# Altium schematic sheet RX5808_TOP.SchDoc
size A4; SheetNumber: 1; SheetTotal: 1
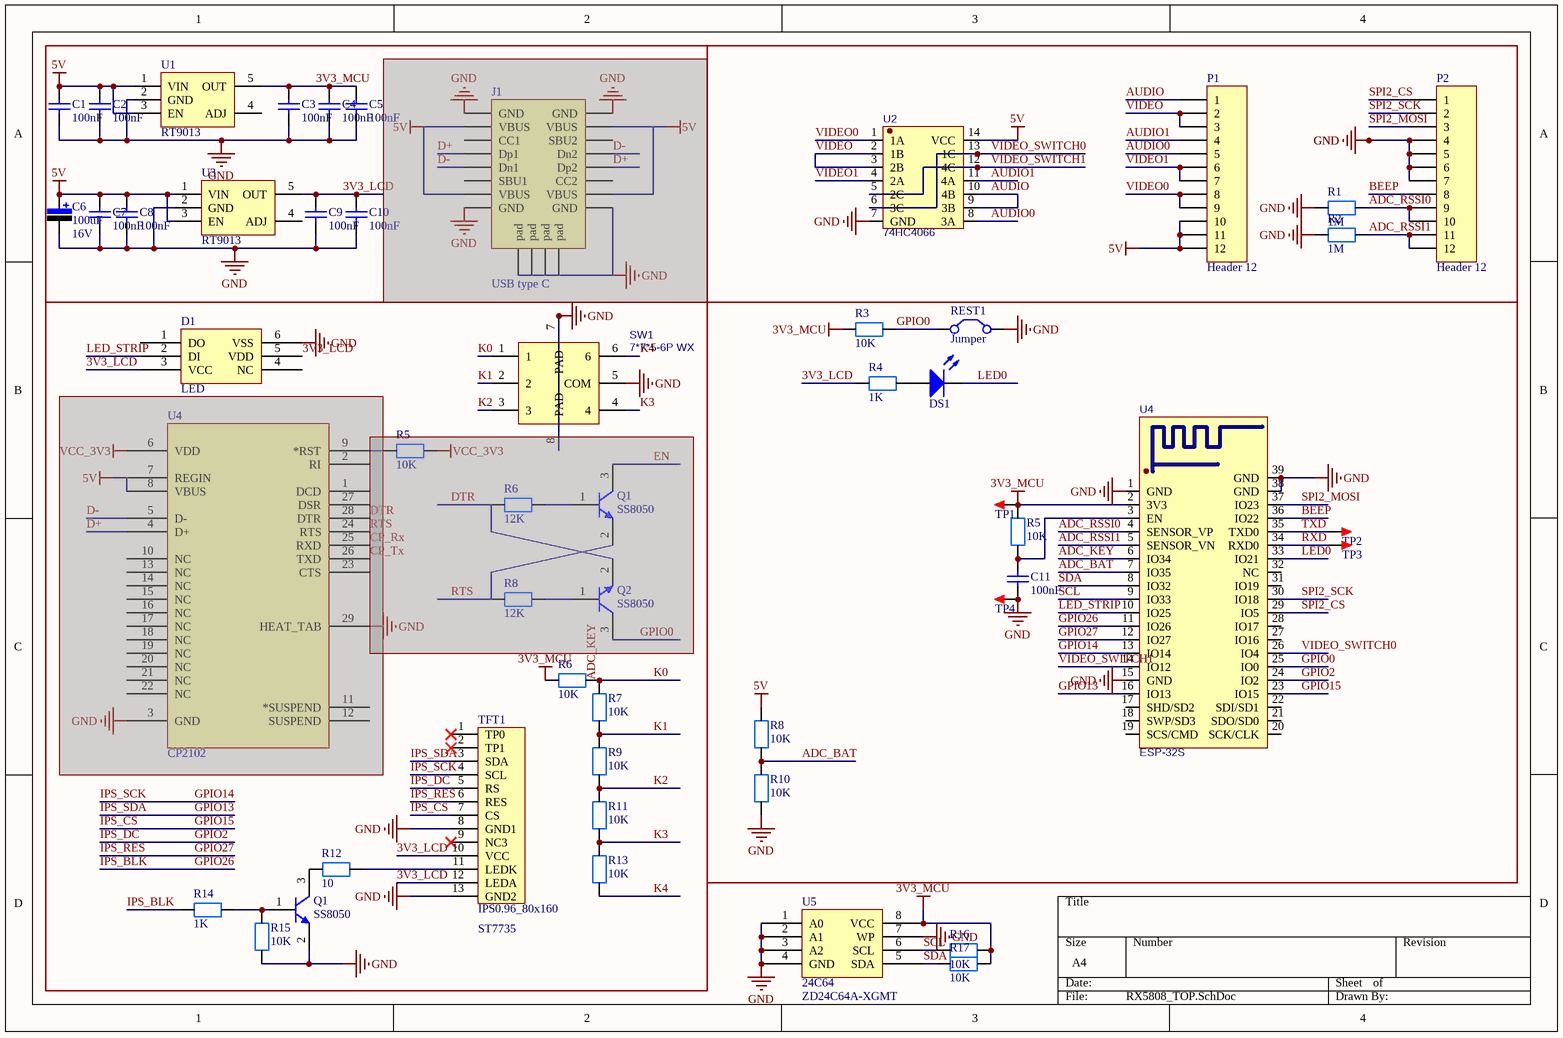
[diagram p0: RX5808_TOP.SchDoc]

## Parts
(Parts that share a designator on the sheet are numbered #1, #2 ... from top to bottom, then left to right.)
C1  value 100nF  [0603_CAP]  (hidden comment: Cap)
C2  value 100nF  [0603_CAP]  (hidden comment: Cap)
C3  value 100nF  [0603_CAP]  (hidden comment: Cap)
C4  value 100nF  [0603_CAP]  (hidden comment: Cap)
C5  value 100nF  [0603_CAP]  (hidden comment: Cap)
C6  value 100uF  Vol: 16V  [CAP-3216]  (hidden comment: Cap Pol)
C7  value 100nF  [0603_CAP]  (hidden comment: Cap)
C8  value 100nF  [0603_CAP]  (hidden comment: Cap)
C9  value 100nF  [0603_CAP]  (hidden comment: Cap)
C10  value 100nF  [0603_CAP]  (hidden comment: Cap)
C11  value 100nF  [0603_CAP]  (hidden comment: Cap)
D1  LED  [LED-SMD_6P-L5.0-W5.0-TL]
DS1  LED  [0603_LED]  (value not drawn)
J1  USB type C  [USB Type-C-16Pin_A]  (masked out: inside a compile mask, not in the netlist)
P1  Header 12  [HDR1.27-1x12]
P2  Header 12  [HDR1.27-1x12]
Q1#1  SS8050  [SOT23A]  (masked out: inside a compile mask, not in the netlist)
Q1#2  SS8050  [SOT23A]
Q2  SS8050  [SOT23A]  (masked out: inside a compile mask, not in the netlist)
R1  1M  [0603_RES]
R2  1M  [0603_RES]
R3  10K  [0603_RES]
R4  1K  [0603_RES]
R5#1  10K  [0603_RES]  (masked out: inside a compile mask, not in the netlist)
R5#2  10K  [0603_RES]
R6#1  12K  [0603_RES]  (masked out: inside a compile mask, not in the netlist)
R6#2  10K  [0603_RES]
R7  10K  [0603_RES]
R8#1  12K  [0603_RES]  (masked out: inside a compile mask, not in the netlist)
R8#2  10K  [0603_RES]
R9  10K  [0603_RES]
R10  10K  [0603_RES]
R11  10K  [0603_RES]
R12  10  [0603_RES]
R13  10K  [0603_RES]
R14  1K  [0603_RES]
R15  10K  [0603_RES]
R16  10K  [0603_RES]
R17  10K  [0603_RES]
REST1  Jumper  [SW-SMD_ST-1195]
SW1  7*7*5-6P WX  [SW-SMD_8P-L7.0-W7.0-P1.40-LS7.4-TL]
TFT1  IPS0.96_80x160  [IPS-0.96]
TP1  TEST  [TEST1.0]  (value not drawn)
TP2  TEST  [TEST1.0]  (value not drawn)
TP3  TEST  [TEST1.0]  (value not drawn)
TP4  TEST  [TEST1.0]  (value not drawn)
U1  RT9013  [SOT-23-5_L3.0-W1.7-P0.95-LS2.8-TL]
U2  74HC4066  [TSSOP-14_L5.0-W4.4-P0.65-LS6.4-BL]
U3  RT9013  [SOT-23-5_L3.0-W1.7-P0.95-LS2.8-TL]
U4#1  CP2102  [QFN-28]  (masked out: inside a compile mask, not in the netlist)
U4#2  ESP-32S  [WIFIM-SMD_ESP-32S]
U5  24C64  [TSSOP-8_L4.4-W3.0-P0.65-LS6.4-BL-2]

## Nets
3V3_MCU: C3.1 C4.2 C5.2 R3.2 R5#2.1 R6#2.1 R16.1 R17.1 TP1.1 U1.5(OUT) U4#2.2(3V3) U5.8(VCC)
5V: C1.2 C2.1 C6.1 C7.2 C8.1 P1.10 P1.11 P1.12 R8#2.2 U1.1(VIN) U1.3(EN) U2.14(VCC) U3.1(VIN) U3.3(EN)
GND: C1.1 C2.2 C3.2 C4.1 C5.1 C6.2 C7.1 C8.2 C9.2 C10.2 C11.2 D1.6(VSS) P2.4 P2.5 P2.6 P2.7 Q1#2.2(E) R1.2 R2.2 R10.1 R15.2 REST1.2(C2) SW1.5(COM) SW1.7(PAD) SW1.8(PAD) TFT1.8(GND1) TFT1.13(GND2) TP4.1 U1.2(GND) U2.7(GND) U3.2(GND) U4#2.1(GND) U4#2.15(GND) U4#2.38(GND) U4#2.39(GND) U5.1(A0) U5.2(A1) U5.3(A2) U5.4(GND) U5.7(WP)
3V3_LCD: C9.1 C10.1 D1.3(VCC) D1.5(VDD) R4.2 TFT1.10(VCC) TFT1.12(LEDA) U3.5(OUT)
ADC_BAT: R8#2.1 R10.2 U4#2.7(IO35)
ADC_KEY: R6#2.2 R7.2 SW1.1 U4#2.6(IO34)  [also labelled K0]
ADC_RSSI0: P2.9 P2.10 R1.1 U4#2.4(SENSOR_VP)
ADC_RSSI1: P2.11 P2.12 R2.1 U4#2.5(SENSOR_VN)
AUDIO: P1.1 U2.9(3B) U2.10(4B)
AUDIO0: P1.5 U2.8(3A)
AUDIO1: P1.4 U2.11(4A)
BEEP: P2.8 U4#2.36(IO22)
GPIO0: R3.1 REST1.1(C1) U4#2.25(IO0)
GPIO2: TFT1.5(RS) U4#2.24(IO2)  [also labelled IPS_DC]
GPIO13: TFT1.3(SDA) U4#2.16(IO13)  [also labelled IPS_SDA]
GPIO14: TFT1.4(SCL) U4#2.13(IO14)  [also labelled IPS_SCK]
GPIO15: TFT1.7(CS) U4#2.23(IO15)  [also labelled IPS_CS]
GPIO26: R14.1 U4#2.11(IO26)  [also labelled IPS_BLK]
GPIO27: TFT1.6(RES) U4#2.12(IO27)  [also labelled IPS_RES]
K1: R7.1 R9.2 SW1.2
K2: R9.1 R11.2 SW1.3
K3: R11.1 R13.2 SW1.4
K4: R13.1 SW1.6
LED0: DS1.2(K) U4#2.33(IO21)
LED_STRIP: D1.2(DI) U4#2.10(IO25)
RXD: TP3.1 U4#2.34(RXD0)
SCL: R16.2 U4#2.9(IO33) U5.6(SCL)
SDA: R17.2 U4#2.8(IO32) U5.5(SDA)
SPI2_CS: P2.1 U4#2.29(IO5)
SPI2_MOSI: P2.3 U4#2.37(IO23)
SPI2_SCK: P2.2 U4#2.30(IO18)
TXD: TP2.1 U4#2.35(TXD0)
VIDEO: P1.2 P1.3 U2.2(1B) U2.3(2B)
VIDEO0: P1.8 P1.9 U2.1(1A)
VIDEO1: P1.6 P1.7 U2.4(2A)
VIDEO_SWITCH0: U2.6(3C) U2.13(1C) U4#2.26(IO4)
VIDEO_SWITCH1: U2.5(2C) U2.12(4C) U4#2.14(IO12)
NetC11_1: C11.1 R5#2.2 U4#2.3(EN)
NetDS1_1: DS1.1(A) R4.1
NetQ1#2_1: Q1#2.1(B) R14.2 R15.1
NetQ1#2_3: Q1#2.3(C) R12.1
NetR12_2: R12.2 TFT1.11(LEDK)

Not connected (* = marked no-connect by the designer): D1 1(DO) 4(NC); TFT1 1(TP0)* 2(TP1)* 9(NC3)*; U1 4(ADJ); U3 4(ADJ); U4#2 17(SHD/SD2) 18(SWP/SD3) 19(SCS/CMD) 20(SCK/CLK) 21(SDO/SD0) 22(SDI/SD1) 27(IO16) 28(IO17) 31(IO19) 32(NC)

## Notes on the sheet
- (near TFT1) ST7735
- (near U5) ZD24C64A-XGMT

## Library data of the parts
C1-C5 C7-C11 = Cap: 无极性电容; Published: 8-Jun-2000; LatestRevisionDate: 17-Jul-2002; LatestRevisionNote: Re-released for DXP Platform.; PackageReference: RAD-0.3; Publisher: Altium Limited
C6 = Cap Pol: 极性电解电容; Published: 8-Jun-2000; LatestRevisionDate: 17-Jul-2002; LatestRevisionNote: Re-released for DXP Platform.; PackageReference: RB7.6-15; Publisher: Altium Limited
D1 = WS2812
J1 = Type-C: TYPEC接口-16PIN
P1 P2 = Header 12: Header, 12-Pin; LatestRevisionDate: 17-Jul-2002; LatestRevisionNote: Re-released for DXP Platform.; Publisher: Altium Limited
Q1#1 Q1#2 Q2 = SS8050: NPN三极管
R1-R4 R5#1 R5#2 R6#1 R6#2 R7 R8#1 R8#2 R9-R17 = RES: 电阻
REST1 = Jumper: 按键; Published: 24-Mar-1999; LatestRevisionDate: 17-Jul-2002; LatestRevisionNote: Re-released for DXP Platform.; PackageReference: RAD-0.2; Publisher: Altium Limited
SW1 = 7*7*5-6P WX: 五向按键; BOM_Manufacturer: SHOU HAN(首韩); Contributor: LCSC; BOM_Supplier: LCSC; BOM_Supplier Part: C2858286; BOM_Manufacturer Part: 7*7*5-6P WX; BOM_JLCPCB Part Class: Extended Part; spicePre: S; spiceSymbolName: 7*7*5-6P WX
TFT1 = IPS0.96_80x160: IPS-135x240; BOM名称: 1.44寸TFT屏; 版权归属: 源创客; 学习资源: www.ooocke.com
TP1-TP4 = TEST: 测试点; 版权归属: 源创客; BOM名称: 测试点; 学习资源: www.ooocke.com
U1 U3 = SPX5205: LDO稳压
U2 = SN74HC4066DBR: BOM_Manufacturer: TI; spicePre: X; BOM_Supplier: LCSC; BOM_Manufacturer Part: SN74HC4066DBR; BOM_Supplier Part: C6849; BOM_JLCPCB Part Class: Extended Part; spiceSymbolName: SN74HC4066DBR
U4#1 = CP2102: USB转TTL; PART DESC: SINGLE-CHIP USB TO UART BRIDGE, QFN28, RoHS.; MFG #1: SILICON LABS; PART NUMBER: CP2102; Value: Value; RefDes: RefDes; Type: DEV
U4#2 = ESP-32S: BOM_Manufacturer: Ai-Thinker; Contributor: LCSC; BOM_Supplier: LCSC; BOM_Supplier Part: C82899; BOM_Manufacturer Part: ESP-32S; BOM_JLCPCB Part Class: Extended Part; spicePre: U; spiceSymbolName: ESP-32S
U5 = 24C02: E2PROM